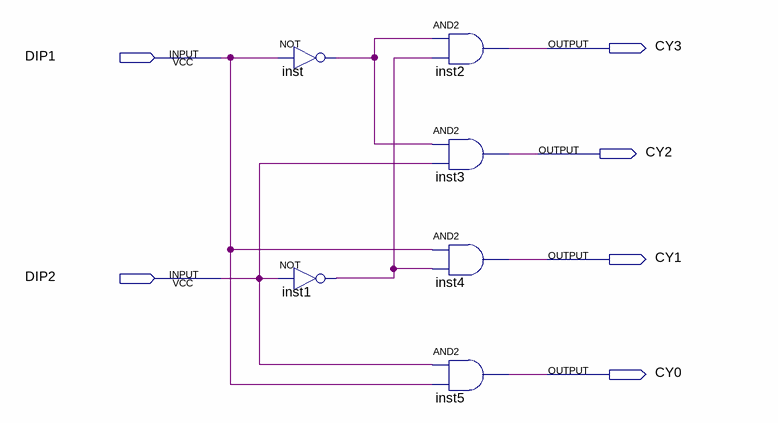
[diagram p0: schematic sheet]
// Quartus schematic TRANS.bdf as structural Verilog: 6 symbols, 6 pins
module TRANS (
  input  DIP1,
  input  DIP2,
  output CY3,
  output CY2,
  output CY1,
  output CY0
);

  wire inst1_out, inst_out;

  not inst (inst_out, DIP1);
  not inst1 (inst1_out, DIP2);
  and inst2 (CY3, inst_out, inst1_out);
  and inst3 (CY2, inst_out, DIP2);
  and inst4 (CY1, DIP1, inst1_out);
  and inst5 (CY0, DIP2, DIP1);
endmodule
